# EasyEDA Pro project ProProject_Hi3861_v2.1_2024-07-26.epro, board PCB2
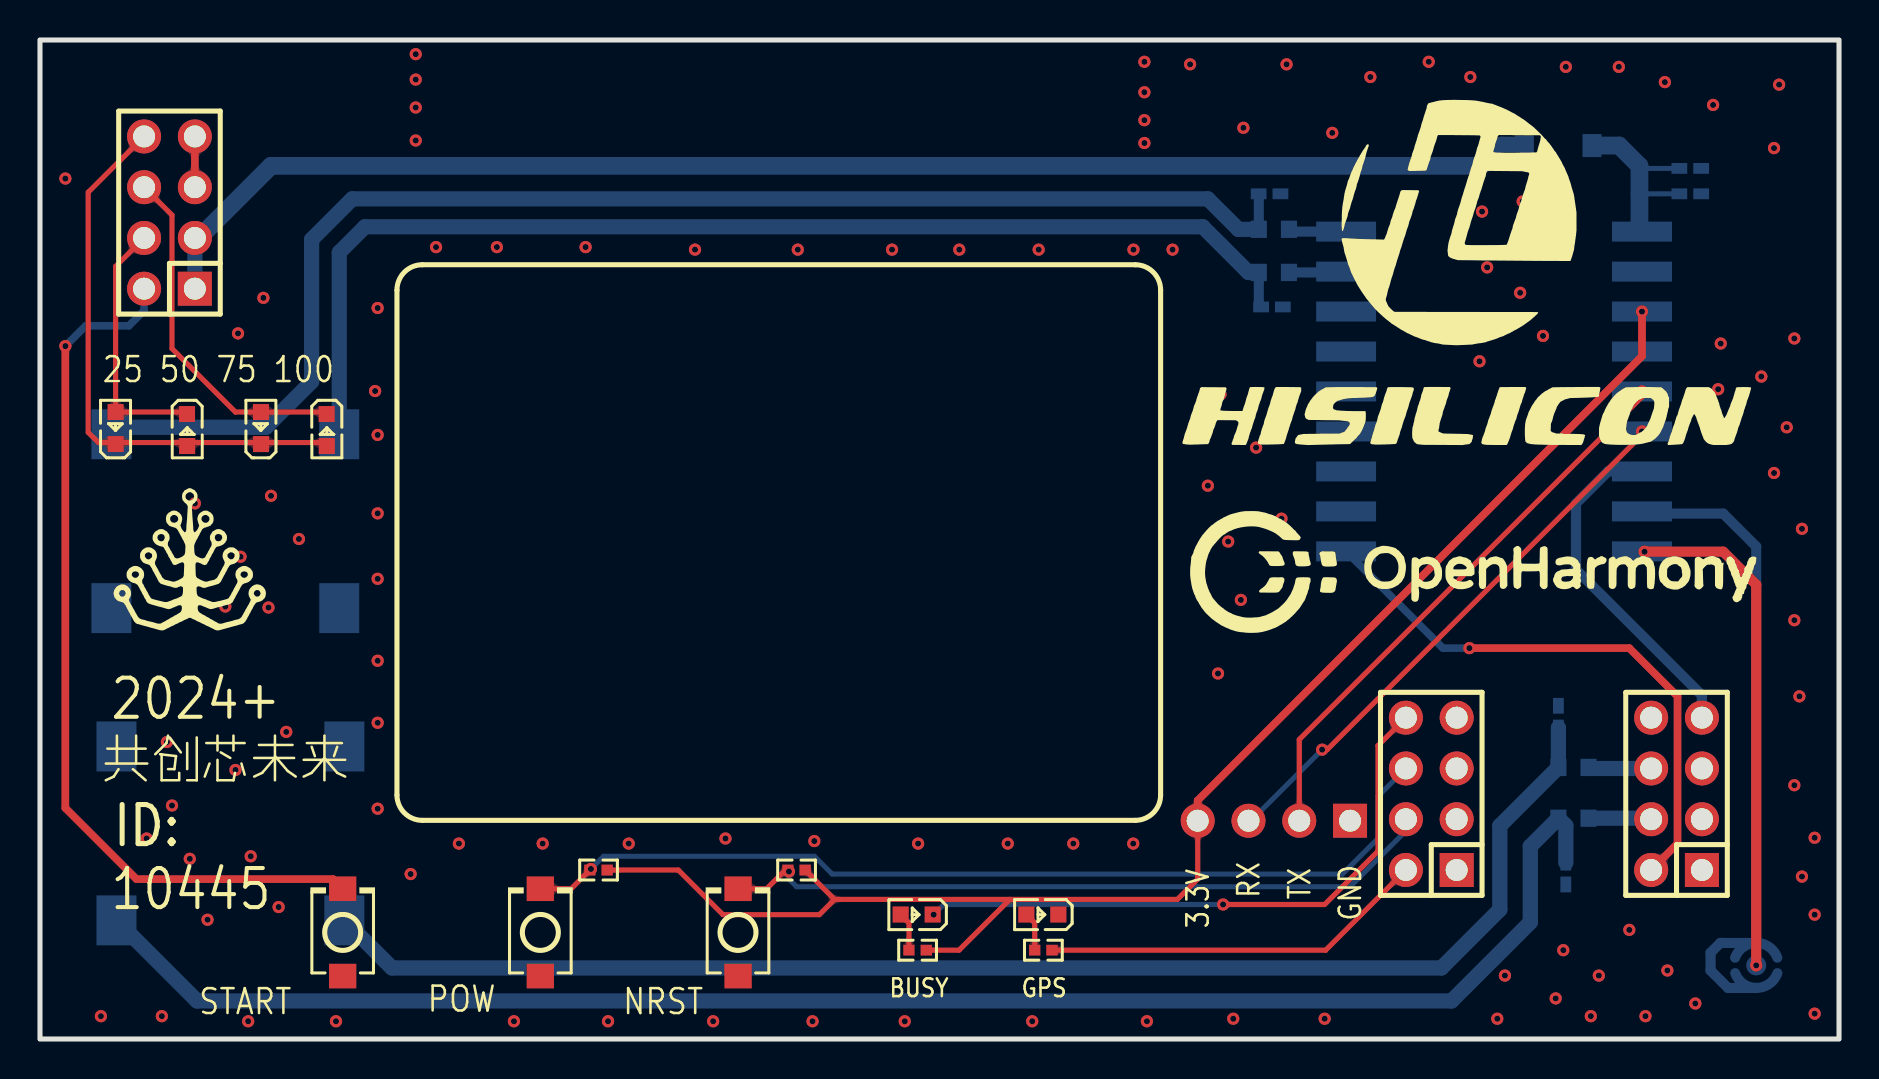
[diagram p10: board, top side]
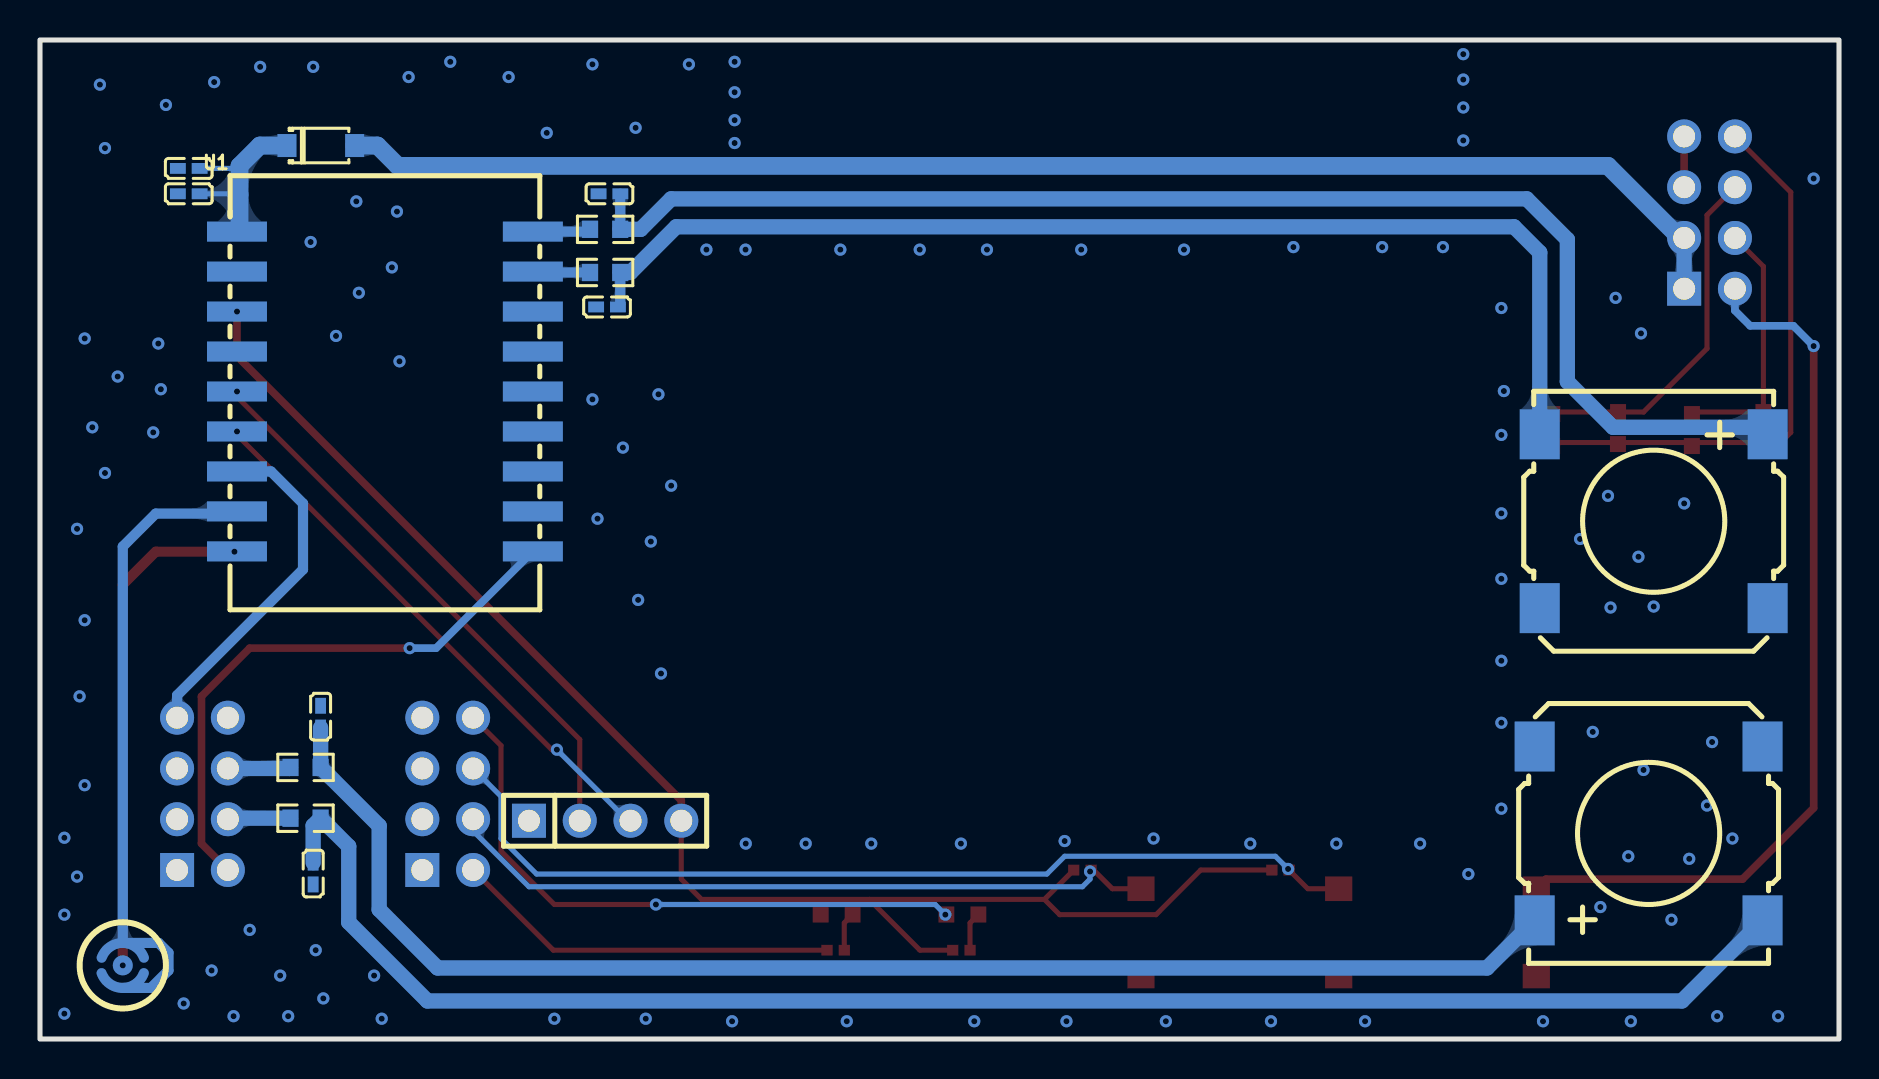
[diagram p11: board, bottom side, seen from below]

Outline 89.99 x 49.99 mm; copper layers: Top Layer, Bottom Layer. Coordinates in mm from the lower left corner of the outline.
Outline path: rectangle 0,49.99 89.99,0
Stack: Top Layer 0.035mm / Dielectric1 1.51mm FR4 er 4.5 / Bottom Layer 0.035mm

## Design rules (mm)
template: JLCPCB Capability(Two Layers Board)
spacing copperThickness1oz (default): track to track 0.102, other pairs 0.152 to 0.3
spacing copperThickness2oz: track to track 0.203, other pairs 0.152 to 0.3
track width copperThickness1oz (default): min 0.127, default 0.254, max 2.54
track width copperThickness2oz: min 0.203, default 0.254, max 2.54
differential pair differentialPair (default): width min 0.127, default 0.254, max 2.54; gap min 0.152, default 0.152
via viaSize (default): diameter min 0.5, default 0.61, max 10; hole min 0.3, default 0.305, max 6.3

## Placement (name value [footprint] x y rotation side)
C1  2u  [C0402]  82.55 43.56 180 bottom
C2  100nF  [C0402]  82.55 42.29 180 bottom
C60  1n  [C0402]  75.95 16.13 270 bottom
C61  1n  [C0402]  76.33 8.28 90 bottom
C62  1n  [C0402]  61.51 42.29 180 bottom
C63  1n  [C0402]  61.63 36.63 180 bottom
D1  DSS24  [SOD-123_L2.8-W1.8-LS3.7-RD]  75.95 44.7 180 bottom
H2  PZ254V-11-04P  [HDR-TH_4P-P2.54-V-M]  61.72 10.92 180 bottom
H3  PZ254V-12-8P  [HDR-TH_8P-P2.54-V-M-R2-C4-S2.54]  81.86 12.27 90 top
H4  PZ254V-12-8P  [HDR-TH_8P-P2.54-V-M-R2-C4-S2.54]  69.6 12.27 90 top
H5  PZ254V-12-8P  [HDR-TH_8P-P2.54-V-M-R2-C4-S2.54]  6.48 41.35 90 top
LED1  -  [LED_0603]  50.09 6.22 180 top
LED3  -  [LED_0603]  14.35 30.42 270 top
LED4  -  [LED_0603]  11.05 30.62 90 top
LED5  -  [LED_0603]  3.78 30.62 90 top
LED6  -  [LED_0603]  7.37 30.42 270 top
LED7  -  [LED_0603]  43.8 6.22 180 top
R18  2k  [R0402]  50.19 4.44 180 top
R19  2k  [R0402]  43.9 4.44 180 top
R20  cizhu  [R0603]  61.72 40.51 180 bottom
R21  cizhu  [R0603]  61.72 38.35 180 bottom
R22  cizhu  [R0603]  76.71 13.59 180 bottom
R23  cizhu  [R0603]  76.71 11.05 180 bottom
R24  2k  [R0402]  37.85 8.45 180 top
R25  2k  [R0402]  27.94 8.45 180 top
SPK1  FS-1340  [BUZ-SMD_4P-L13.0-W13.0-P11.4-BL]  9.27 25.91 0 bottom
SPK2  FS-1340  [BUZ-SMD_4P-L13.0-W13.0-P11.4-BL]  9.53 10.29 180 bottom
SW5  TS-1088R-02026  [SW-SMD_L3.9-W3.0-P4.45]  25.03 5.33 90 top
SW6  TS-1088R-02026  [SW-SMD_L3.9-W3.0-P4.45]  34.92 5.33 90 top
SW7  TS-1088R-02026  [SW-SMD_L3.9-W3.0-P4.45]  15.14 5.33 90 top
U1  SU-03T  [COMM-SMD_18P-L21.0-W15.0-P2.00]  72.74 32.4 180 bottom
U2  WB4013AT-XHD-D2  [MIC-SMD_BD4.0_MIC.X-4013-SMD]  85.85 3.68 180 bottom

## Footprints (pads in the part's own frame, mm; a bottom-side part is the same pattern mirrored in y, then rotated)
BUZ-SMD_4P-L13.0-W13.0-P11.4-BL
  rect 2x2.5 smd: 1(-5.7,-4.35) 2(5.7,-4.35) 3(5.7,4.35) 4(-5.7,4.35)
C0402
  rect 0.79x0.54 smd: 1(-0.545,0) 2(0.545,0)
COMM-SMD_18P-L21.0-W15.0-P2.00
  rect 3x1 smd: 1(-7.4,8) 2(-7.4,6) 3(-7.4,4) 4(-7.4,2) 5(-7.4,0) 6(-7.4,-2.001) 7(-7.4,-4) 8(-7.4,-6) 9(-7.4,-8) 10(7.4,-8) 11(7.4,-6) 12(7.4,-4) 13(7.4,-2) 14(7.4,0) 15(7.4,2) 16(7.4,4) 17(7.4,6) 18(7.4,8)
HDR-TH_4P-P2.54-V-M
  rect 1.7x1.7 hole 1.1: 1(-3.81,0)
  round 1.7 hole 1.1: 2(-1.27,0) 3(1.27,0) 4(3.81,0)
HDR-TH_8P-P2.54-V-M-R2-C4-S2.54
  rect 1.7x1.7 hole 1.1: 1(-3.81,-1.27)
  round 1.7 hole 1.1: 2(-3.81,1.27) 3(-1.27,-1.27) 4(-1.27,1.27) 5(1.27,-1.27) 6(1.27,1.27) 7(3.81,-1.27) 8(3.81,1.27)
LED_0603
  rect 0.8x0.8 smd: 1(-0.851,-0.01) 2(0.75,-0.005)
MIC-SMD_BD4.0_MIC.X-4013-SMD
  round 1 smd: 1(0.002,0.002)
  custom 2.614x1.24 smd: 2(-0.002,-1.125) 2(0.002,1.125)
R0402
  rect 0.566x0.54 smd: 1(-0.433,0) 2(0.433,0)
R0603
  rect 0.806x0.864 smd: 1(-0.753,0) 2(0.753,0)
SOD-123_L2.8-W1.8-LS3.7-RD
  rect 0.95x1.15 smd: 1(-1.692,0) 2(1.692,0)
SW-SMD_L3.9-W3.0-P4.45
  rect 1.23x1.36 smd: 1(-2.185,0) 2(2.185,0)

## Nets
As in the schematic.

Pads without a net: H3 8; SPK1 3 4; SPK2 3 4; U1 4 11 12 13 14 15

## Via types
v1: diameter 0.61, hole 0.305, Top Layer to Bottom Layer, 132 vias

## Routing (per net, layer and track width the routed paths; a pad name or vN(x,y) marks a point on that pad's centre or on a via; arc(x,y) is an arc through that point)
3.3V_SU03T: length 76.1
  Top Layer w0.254: 48.51,6.98 45.97,4.44 R19.1 ; 48.51,6.98 56.9,6.98 57.91,8 H2.4 ; 48.51,6.98 39.75,6.98 ; R25.1 31.93,8.45 34.16,6.22 38.99,6.22 39.75,6.98 ; 39.75,6.98 R24.1
  Top Layer w0.381: v1(80.14,36.4) 80.14,34.16 57.91,11.94 H2.4
5V: length 71
  Bottom Layer w0.762: H5.1 H5.3
  Bottom Layer w0.889: H5.3 7.95,40.08 11.56,43.69 72.09,43.69 73.11,44.7 D1.2
GND: length 2.5
  Top Layer w0.381: H5.5 H5.7
  vias: v1(1.27,43.05) v1(3.05,1.14) v1(5.33,10.03) v1(6.1,1.14) v1(6.35,14.86) v1(6.6,11.68) v1(7.49,9.02) v1(7.75,26.8) v1(8.38,5.97) v1(9.27,21.64) v1(9.78,13.46) v1(9.91,35.31) v1(10.03,24.13) v1(10.41,0.89) v1(10.54,9.14) v1(11.18,37.08) v1(11.43,21.59) v1(11.56,27.18) v1(11.94,6.6) v1(12.32,15.37) v1(12.95,25.02) v1(14.81,0.89) v1(16.76,32.42) v1(16.89,36.58) v1(16.89,30.23) v1(16.89,26.3) v1(16.89,23.03) v1(16.89,18.93) v1(16.89,15.82) v1(16.89,11.53) v1(18.54,8.25) v1(18.8,49.28) v1(18.8,48.01) v1(18.8,46.61) v1(18.8,44.96) v1(19.81,39.62) v1(20.95,9.78) v1(22.85,39.62) v1(23.71,0.89) v1(25.15,9.78) v1(27.29,39.62) v1(28.41,0.89) v1(29.45,9.78) v1(32.77,39.5) v1(33.67,0.89) v1(34.29,10.03) v1(37.91,39.5) v1(38.65,0.89) v1(38.74,9.91) v1(42.62,39.5) v1(43.26,0.89) v1(43.93,9.78) v1(45.99,39.5) v1(48.41,9.78) v1(49.63,0.89) v1(49.96,39.5) v1(51.69,9.78) v1(54.7,39.5) v1(54.69,9.78) v1(55.25,48.89) v1(55.25,47.37) v1(55.25,45.97) v1(55.25,44.83) v1(55.37,0.89) v1(56.66,39.5) v1(57.53,48.77) v1(58.42,27.69) v1(58.93,18.29) v1(59.06,32.26) v1(59.44,24.89) v1(59.69,1.02) v1(60.07,21.97) v1(60.2,45.59) v1(60.83,29.59) v1(62.1,26.03) v1(62.36,48.77) v1(62.36,32) v1(64.26,1.02) v1(64.64,45.34) v1(66.55,48.13) v1(69.47,48.89) v1(71.55,48.13) v1(72.01,33.91) v1(72.14,41.4) v1(72.39,38.61) v1(72.9,1.02) v1(73.28,3.17) v1(74.04,37.34) v1(74.17,41.91) v1(75.18,35.18) v1(75.82,2.03) v1(76.2,4.44) v1(76.33,48.64) v1(76.45,39.88) v1(77.58,1.14) v1(77.98,3.17) v1(78.98,48.64) v1(79.5,5.46) v1(80.31,1.14) v1(81.28,47.88) v1(81.41,3.43) v1(82.8,1.78) v1(83.69,46.74) v1(83.95,32.51) v1(84.07,34.8) v1(84.33,30.35) v1(86.11,33.15) v1(86.74,44.58) v1(86.74,28.32) v1(87,47.75) v1(87.38,30.61) v1(87.76,35.05) v1(87.76,20.95) v1(87.76,12.7) v1(88.01,17.14) v1(88.14,25.53) v1(88.14,8.13) v1(88.77,10.07) v1(88.77,6.22) v1(88.77,1.27)
1PPS: length 19.4
  Top Layer w0.254: H4.2 64.31,4.44 R18.1
8266_BUSY: length 30.9
  Top Layer w0.254: v1(59.18,6.73) 64.26,6.73 66.93,9.4 66.93,14.68 H4.8 ; LED7.1 44.66,6.22 v1(44.7,6.22)
  Bottom Layer w0.254: v1(59.18,6.73) 45.21,6.73 v1(44.7,6.22)
8266_N: length 3.2
  Bottom Layer w0.762: H3.6 77.51,13.54 R22.1
8266_P: length 3.2
  Bottom Layer w0.762: R23.1 80.54,11.05 H3.4
IP5306_KEY: length 44.4
  Top Layer w0.381: v1(1.27,34.67) 1.27,11.56 4.83,8 14.66,8 SW7.2
  Bottom Layer w0.381: v1(1.27,34.67) 2.29,35.69 4.44,35.69 5.21,36.45 H5.2
LED1: length 12.9
  Top Layer w0.254: H5.4 3.78,38.66 LED5.2 7.26,31.37 LED6.1
LED2: length 17.7
  Top Layer w0.254: LED3.1 14.24,31.37 LED4.2 9.78,31.37 6.6,34.54 6.6,41.22 H5.6
LED3: length 28.2
  Top Layer w0.254: H5.8 2.41,42.37 2.41,30.35 2.92,29.84 14.17,29.84 LED3.2
MCU_RX/03_TX: length 17.3
  Bottom Layer w0.508: U1.7 78.44,28.4 76.84,26.8 76.84,23.5 83.13,17.2 H3.7
MCU_TX/03_RX: length 28.8
  Top Layer w0.381: H3.2 81.91,9.78 81.91,17.14 79.5,19.56 v1(71.5,19.56)
  Bottom Layer w0.381: U1.10 70.18,19.56 v1(71.5,19.56)
MIC+: length 25.5
  Top Layer w0.508: v1(80.26,24.38) 84.2,24.38 85.85,22.73 v1(85.85,3.68)
  Bottom Layer w0.508: v1(80.26,24.38) 80.15,24.38 80.14,24.4
MIC-: length 32.3
  Bottom Layer w0.508: U2.2 84.44,2.56 83.57,3.43 83.57,4.32 84.06,4.81 U2.2 85.85,24.64 84.2,26.29 80.25,26.29 80.14,26.4
NRST: length 36.1
  Top Layer w0.254: SW6.2 36.35,7.52 37.28,8.45 R24.2
  Top Layer w0.508: R24.2 37.47,8.4 v1(37.47,8.38)
  Bottom Layer w0.254: H4.4 68.33,10.41 65.53,7.62 37.85,7.62 37.47,8 v1(37.47,8.38)
PWO: length 47.8
  Top Layer w0.254: SW5.2 26.57,7.52 27.51,8.45 ; v1(27.56,8.51) 27.51,8.46
  Bottom Layer w0.254: H4.6 66.93,12.14 66.93,10.03 65.15,8.25 39.62,8.25 38.74,9.14 28.19,9.14 v1(27.56,8.51)
SPEAKER+: length 68.9
  Bottom Layer w0.508: C62.2 60.97,42.28 R20.2
  Bottom Layer w0.762: SPK1.1 3.92,30.61 11.3,30.61 13.59,32.89 13.59,40 15.62,42.04 58.42,42.04 59.94,40.51 R20.2
SPEAKER-: length 58.3
  Bottom Layer w0.508: R21.2 60.97,36.74 C63.2
  Bottom Layer w0.762: R21.2 60.45,38.35 58.17,40.64 16.26,40.64 14.97,39.36 SPK1.2
SU03T_RX/CH340_TX: length 27.9
  Top Layer w0.254: v1(80.14,30.4) 80.14,30.23 64.39,14.48 v1(64.13,14.48)
  Bottom Layer w0.254: v1(64.13,14.48) 60.58,10.92 H2.3
SU03T_TX/CH340_RX: length 28.6
  Top Layer w0.254: H2.2 62.99,14.99 80.14,32.13 v1(80.14,32.4)
VN: length 70.3
  Bottom Layer w0.762: C60.2 R22.2 75.95,13.59 73.03,10.67 73.03,6.48 70.1,3.56 17.61,3.56 15.22,5.94
VP: length 82.2
  Bottom Layer w0.762: 3.83,5.94 7.86,1.91 70.61,1.91 74.55,5.84 74.55,9.64 R23.2 76.33,10.68 C61.2
$1N550: length 2
  Top Layer w0.254: LED1.2 49.76,5.81 49.76,4.44
$1N778: length 10.2
  Bottom Layer w0.254: 80.01,42.25 80.05,42.29 82,42.29 ; 80.01,43.69 80.14,43.56 82,43.56
  Bottom Layer w0.889: U1.1 80.01,40.53 80.01,43.69 78.99,44.7 D1.1
$1N848: length 2
  Top Layer w0.254: LED7.2 43.47,5.81 R19.2
$1N1553: length 2.9
  Bottom Layer w0.508: R20.1 62.59,40.4 U1.18
$1N1585: length 2.9
  Bottom Layer w0.508: R21.1 65.29,38.35 U1.17

## Copper pours and planes (outline as drawn; the poured copper is in the pictures)
GND on Top Layer: -2.03,52.83 91.19,52.83 91.19,-7.37 -2.03,-7.37
GND on Bottom Layer: -6.6,50.67 98.3,50.67 98.3,-1.52 -6.6,-1.52

Small or netless copper shapes (teardrops, artwork), in the pictures only: 53 on Top Layer, 48 on Bottom Layer

## Text on the board
Top Silkscreen Layer: BUSY | GPS | 3.3V | RX | TX | GND | 25 50 75 100 | START | POW | NRST | 2024+ | 10445 | ID: | 共创芯未来
